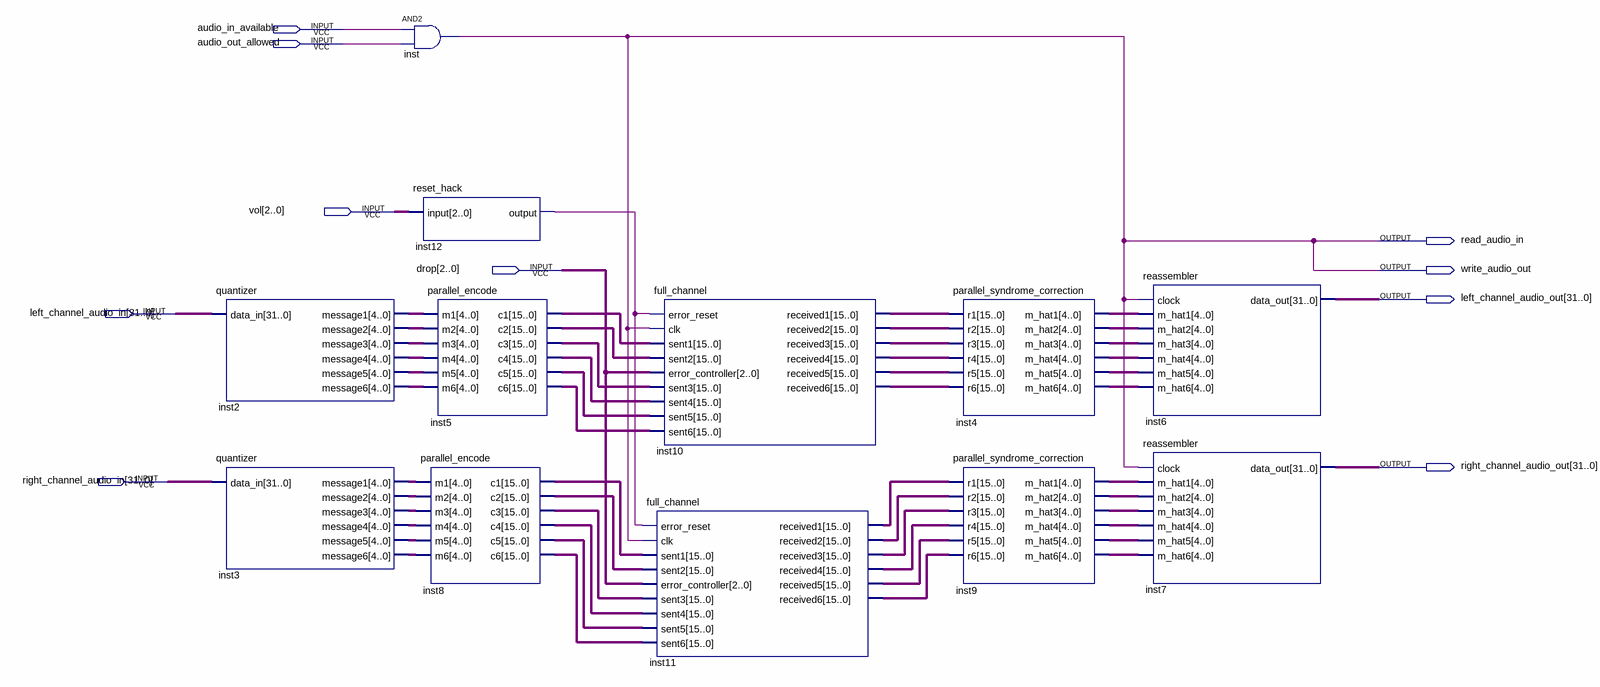
[diagram p0: schematic sheet]
// Quartus schematic filter_demo.bdf as structural Verilog: 12 symbols, 10 pins
module filter_demo (
  input  audio_in_available,
  input  audio_out_allowed,
  input  [2:0] vol,
  input  [2:0] drop,
  input  [31:0] left_channel_audio_in,
  input  [31:0] right_channel_audio_in,
  output read_audio_in,
  output write_audio_out,
  output [31:0] left_channel_audio_out,
  output [31:0] right_channel_audio_out
);

  wire inst12_output;
  wire [4:0] inst2_message1, inst2_message2, inst2_message3, inst2_message4, inst2_message5, inst2_message6,
       inst3_message1, inst3_message2, inst3_message3, inst3_message4, inst3_message5, inst3_message6,
       inst4_m_hat1, inst4_m_hat2, inst4_m_hat3, inst4_m_hat4, inst4_m_hat5, inst4_m_hat6, inst9_m_hat1,
       inst9_m_hat2, inst9_m_hat3, inst9_m_hat4, inst9_m_hat5, inst9_m_hat6;
  wire [15:0] inst5_c1, inst5_c2, inst5_c3, inst5_c4, inst5_c5, inst5_c6, inst8_c1, inst8_c2, inst8_c3,
       inst8_c4, inst8_c5, inst8_c6, inst10_received1, inst10_received2, inst10_received3, inst10_received4,
       inst10_received5, inst10_received6, inst11_received1, inst11_received2, inst11_received3,
       inst11_received4, inst11_received5, inst11_received6;

  quantizer inst2 (
    .data_in(left_channel_audio_in), .message1(inst2_message1), .message2(inst2_message2),
    .message3(inst2_message3), .message4(inst2_message4), .message5(inst2_message5), .message6(inst2_message6));
  quantizer inst3 (
    .data_in(right_channel_audio_in), .message1(inst3_message1), .message2(inst3_message2),
    .message3(inst3_message3), .message4(inst3_message4), .message5(inst3_message5), .message6(inst3_message6));
  and inst (read_audio_in, audio_in_available, audio_out_allowed);
  reset_hack inst12 (.\input (vol), .\output (inst12_output));
  parallel_encode inst5 (
    .m1(inst2_message1), .m2(inst2_message2), .m3(inst2_message3), .m4(inst2_message4), .m5(inst2_message5),
    .m6(inst2_message6), .c1(inst5_c1), .c2(inst5_c2), .c3(inst5_c3), .c4(inst5_c4), .c5(inst5_c5),
    .c6(inst5_c6));
  parallel_encode inst8 (
    .m1(inst3_message1), .m2(inst3_message2), .m3(inst3_message3), .m4(inst3_message4), .m5(inst3_message5),
    .m6(inst3_message6), .c1(inst8_c1), .c2(inst8_c2), .c3(inst8_c3), .c4(inst8_c4), .c5(inst8_c5),
    .c6(inst8_c6));
  full_channel inst10 (
    .error_reset(inst12_output), .clk(read_audio_in), .sent1(inst5_c1), .sent2(inst5_c2),
    .error_controller(drop), .sent3(inst5_c3), .sent4(inst5_c4), .sent5(inst5_c5), .sent6(inst5_c6),
    .received1(inst10_received1), .received2(inst10_received2), .received3(inst10_received3),
    .received4(inst10_received4), .received5(inst10_received5), .received6(inst10_received6));
  full_channel inst11 (
    .error_reset(inst12_output), .clk(read_audio_in), .sent1(inst8_c1), .sent2(inst8_c2),
    .error_controller(drop), .sent3(inst8_c3), .sent4(inst8_c4), .sent5(inst8_c5), .sent6(inst8_c6),
    .received1(inst11_received1), .received2(inst11_received2), .received3(inst11_received3),
    .received4(inst11_received4), .received5(inst11_received5), .received6(inst11_received6));
  parallel_syndrome_correction inst4 (
    .r1(inst10_received1), .r2(inst10_received2), .r3(inst10_received3), .r4(inst10_received4),
    .r5(inst10_received5), .r6(inst10_received6), .m_hat1(inst4_m_hat1), .m_hat2(inst4_m_hat2),
    .m_hat3(inst4_m_hat3), .m_hat4(inst4_m_hat4), .m_hat5(inst4_m_hat5), .m_hat6(inst4_m_hat6));
  parallel_syndrome_correction inst9 (
    .r1(inst11_received1), .r2(inst11_received2), .r3(inst11_received3), .r4(inst11_received4),
    .r5(inst11_received5), .r6(inst11_received6), .m_hat1(inst9_m_hat1), .m_hat2(inst9_m_hat2),
    .m_hat3(inst9_m_hat3), .m_hat4(inst9_m_hat4), .m_hat5(inst9_m_hat5), .m_hat6(inst9_m_hat6));
  reassembler inst6 (
    .clock(read_audio_in), .m_hat1(inst4_m_hat1), .m_hat2(inst4_m_hat2), .m_hat3(inst4_m_hat3),
    .m_hat4(inst4_m_hat4), .m_hat5(inst4_m_hat5), .m_hat6(inst4_m_hat6), .data_out(left_channel_audio_out));
  reassembler inst7 (
    .clock(read_audio_in), .m_hat1(inst9_m_hat1), .m_hat2(inst9_m_hat2), .m_hat3(inst9_m_hat3),
    .m_hat4(inst9_m_hat4), .m_hat5(inst9_m_hat5), .m_hat6(inst9_m_hat6), .data_out(right_channel_audio_out));

  assign write_audio_out = read_audio_in;
endmodule
